# Altium schematic sheet Power.SchDoc
size A4
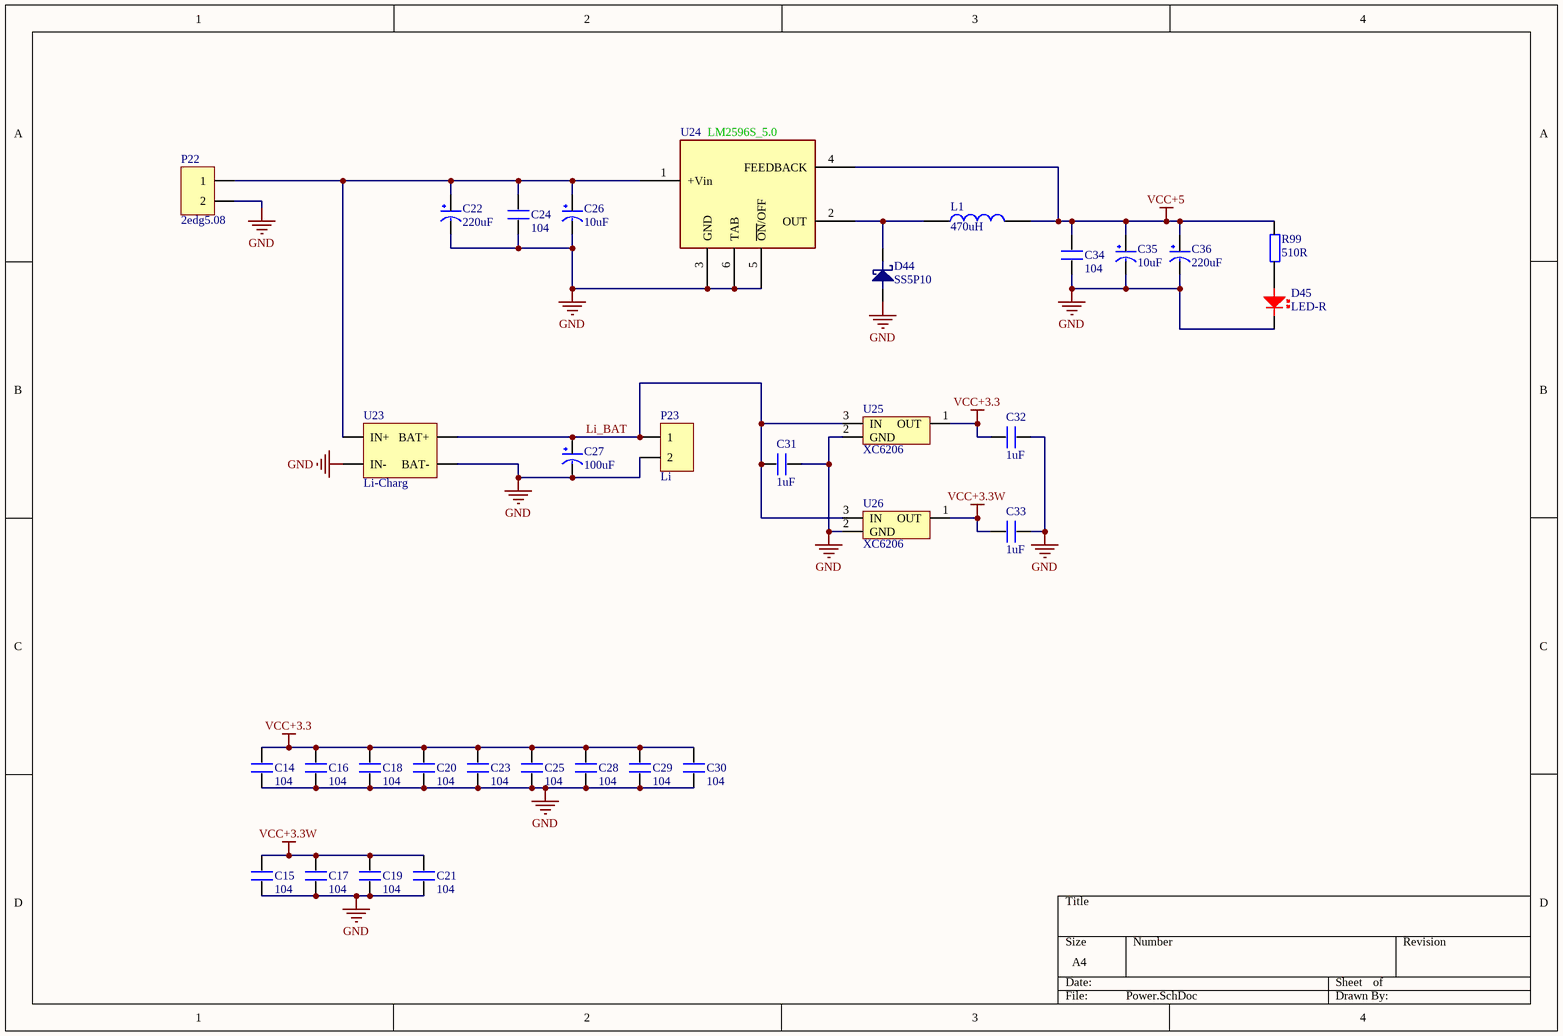
[diagram p0: Power.SchDoc]

## Parts
C14  104  [0805-CAP]
C15  104  [0805-CAP]
C16  104  [0805-CAP]
C17  104  [0805-CAP]
C18  104  [0805-CAP]
C19  104  [0805-CAP]
C20  104  [0805-CAP]
C21  104  [0805-CAP]
C22  220uF  [CAP3.0]
C23  104  [0805-CAP]
C24  104  [0805-CAP]
C25  104  [0805-CAP]
C26  10uF  [CAP3.0]
C27  100uF  [CAP2.54]
C28  104  [0805-CAP]
C29  104  [0805-CAP]
C30  104  [0805-CAP]
C31  1uF  [0805-CAP]
C32  1uF  [0805-CAP]
C33  1uF  [0805-CAP]
C34  104  [0805-CAP]
C35  10uF  [CAP3.0]
C36  220uF  [CAP3.0]
D44  SS5P10  [TO-277A]
D45  LED-R  [DIO-LIG]
L1  470uH  [MSS1278CUST]
P22  2edg5.08  [2edg5.08_2]
P23  Li  [2edg5.08_2]
R99  510R  [0805-RES]
U23  Li-Charg  [Li-Charg]
U24  LM2596S_5.0  [TO-263-5-2]
U25  XC6206  [SOT-23R]
U26  XC6206  [SOT-23R]

## Nets
GND: C14.1 C15.1 C16.1 C17.1 C18.1 C19.1 C20.1 C21.1 C22.2(GND) C23.1 C24.1 C25.1 C26.2(GND) C27.2(GND) C28.1 C29.1 C30.1 C31.2 C32.2 C33.2 C34.1 C35.2(GND) C36.2(GND) D44.1 D45.2 P22.2 P23.2 U23.2(IN-) U23.3(BAT-) U24.3(GND) U24.5(~{ON}/OFF) U24.6(TAB) U25.2(GND) U26.2(GND)
VCC+3.3: C14.2 C16.2 C18.2 C20.2 C23.2 C25.2 C28.2 C29.2 C30.2 C32.1 U25.1(OUT)
VCC+3.3W: C15.2 C17.2 C19.2 C21.2 C33.1 U26.1(OUT)
VCC+5: C34.2 C35.1(VCC) C36.1(VCC) L1.2 R99.2 U24.4(FEEDBACK)
Li_BAT: C27.1(VCC) C31.1 P23.1 U23.4(BAT+) U25.3(IN) U26.3(IN)
NetC22_1: C22.1(VCC) C24.2 C26.1(VCC) P22.1 U23.1(IN+) U24.1(+Vin)
NetD44_2: D44.2 L1.1 U24.2(OUT)
NetD45_1: D45.1 R99.1

## Library data of the parts
C14-C21 C23-C25 C28-C34 = C
C22 C26 C27 C35 C36 = CAP
D44 = SS5P10: 肖特基二极管
D45 = LED-RED: 红色LED
L1 = INDUCTOR
P22 P23 = 2EDG5.08_2: 端子
R99 = Res
U23 = Li-Charg: 锂电池充电模块
U24 = LM2596S_5.0: 3A开关电源芯片
U25 U26 = XC6206: LDO